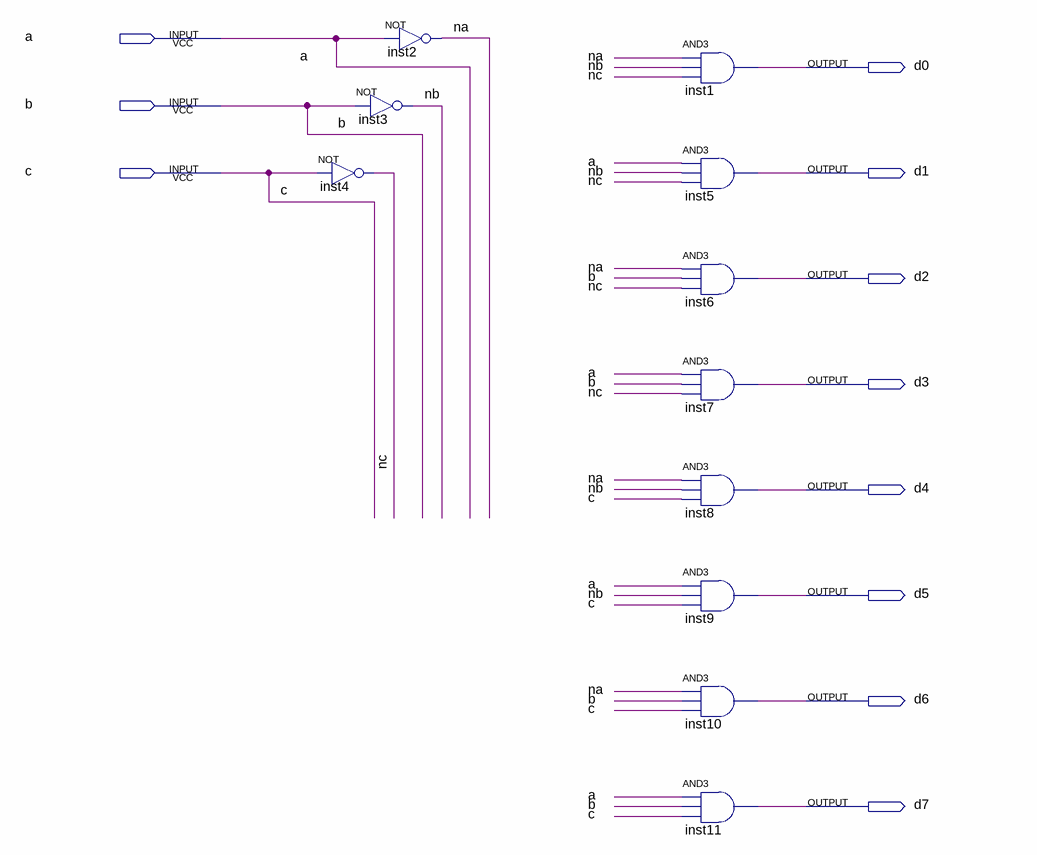
[diagram p0: schematic sheet]
// Quartus schematic decod3x8.bdf as structural Verilog: 11 symbols, 11 pins
module decod3x8 (
  input  a,
  input  b,
  input  c,
  output d0,
  output d1,
  output d2,
  output d3,
  output d4,
  output d5,
  output d6,
  output d7
);

  wire na, nb, nc;

  not inst3 (nb, b);
  not inst4 (nc, c);
  not inst2 (na, a);
  and inst1 (d0, na, nb, nc);
  and inst5 (d1, a, nb, nc);
  and inst6 (d2, na, b, nc);
  and inst7 (d3, a, b, nc);
  and inst8 (d4, na, nb, c);
  and inst9 (d5, a, nb, c);
  and inst10 (d6, na, b, c);
  and inst11 (d7, a, b, c);
endmodule
